# Altium schematic sheet 04_CONNECTOR_IN.SchDoc
size 420 x 297 mm; SheetNumber: 4; SheetTotal: 29
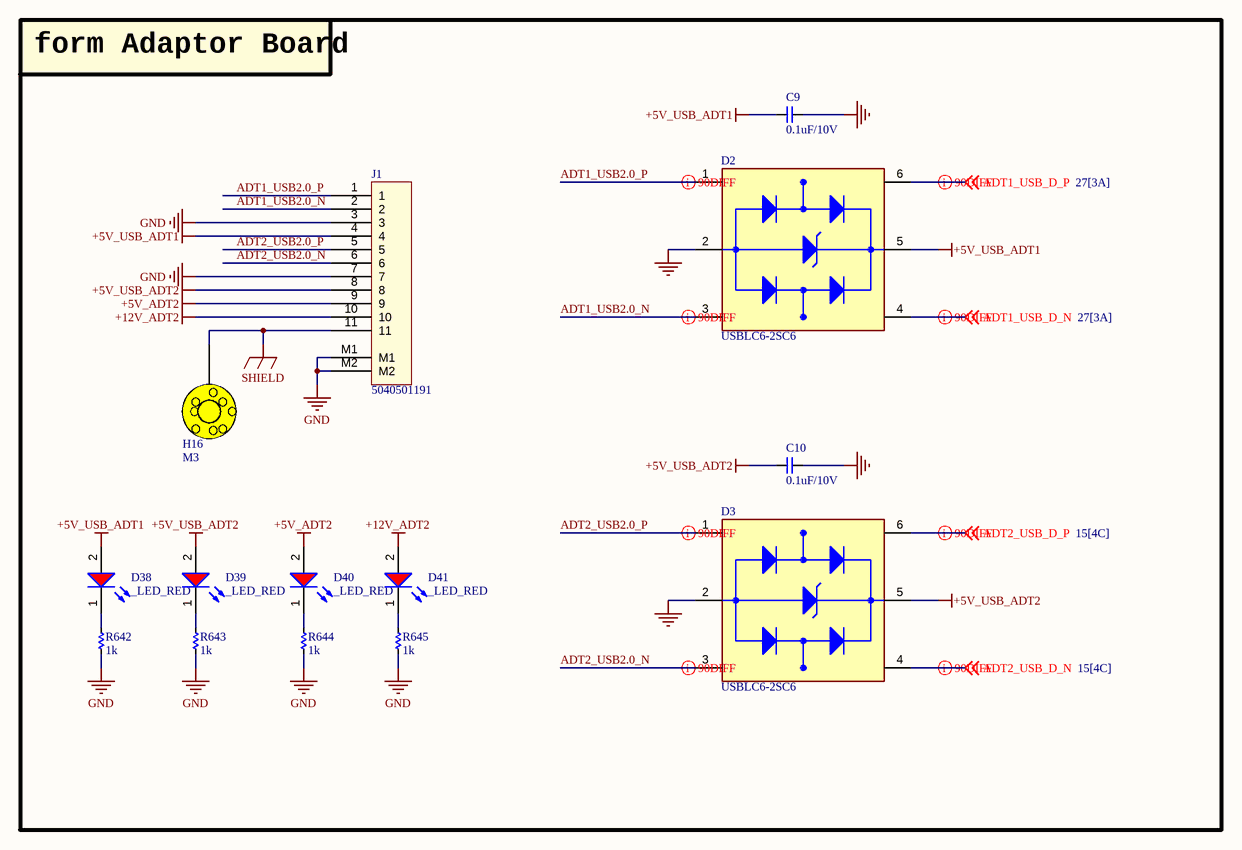
[diagram p0: 04_CONNECTOR_IN.SchDoc]

## Parts
C9  0.1uF/10V  [CAP_C_1005X60]
C10  0.1uF/10V  [CAP_C_1005X60]
D2  USBLC6-2SC6  [SOT95P280X145-6N]
D3  USBLC6-2SC6  [SOT95P280X145-6N]
D38  _LED_RED  [LED_0603]
D39  _LED_RED  [LED_0603]
D40  _LED_RED  [LED_0603]
D41  _LED_RED  [LED_0603]
H16  M3  [Testpoint_TH_D350H250]
J1  5040501191  [MOLEX_5040501191]
R642  1k  [RES_C_1005X40]
R643  1k  [RES_C_1005X40]
R644  1k  [RES_C_1005X40]
R645  1k  [RES_C_1005X40]

## Blocks framed on the sheet
form Adaptor Board: C9 C10 D2 D3 D38-D41 H16 J1 R642-R645

## Nets
+5V_ADT2: D40.2(A) J1.9
+5V_USB_ADT1: C9.2 D2.5(VBUS) D38.2(A) J1.4
+5V_USB_ADT2: C10.2 D3.5(VBUS) D39.2(A) J1.8
+12V_ADT2: D41.2(A) J1.10
GND: C9.1 C10.1 D2.2(GND) D3.2(GND) J1.3 J1.7 J1.M1 J1.M2 R642.1 R643.1 R644.1 R645.1
SHIELD: H16.1 J1.11
ADT1_USB2.0_N: D2.3(I/O2_IN) J1.2
ADT1_USB2.0_P: D2.1(I/O1_IN) J1.1
ADT1_USB_D_N: D2.4(I/O2_OUT) ; off-sheet ADT1_USB_D_N
ADT1_USB_D_P: D2.6(I/O1_OUT) ; off-sheet ADT1_USB_D_P
ADT2_USB2.0_N: D3.3(I/O2_IN) J1.6
ADT2_USB2.0_P: D3.1(I/O1_IN) J1.5
ADT2_USB_D_N: D3.4(I/O2_OUT) ; off-sheet ADT2_USB_D_N
ADT2_USB_D_P: D3.6(I/O1_OUT) ; off-sheet ADT2_USB_D_P
NetD38_1: D38.1(K) R642.2
NetD39_1: D39.1(K) R643.2
NetD40_1: D40.1(K) R644.2
NetD41_1: D41.1(K) R645.2

## Layout directives
differential pair; differential pair class DIFF90: ADT1_USB2.0_N, ADT1_USB2.0_P, ADT1_USB_D_N, ADT1_USB_D_P, ADT2_USB2.0_N, ADT2_USB2.0_P, ADT2_USB_D_N, ADT2_USB_D_P

## Notes on the sheet
- Project:
- Sub-system:
- Design by:
- Sheet title:
- Sheet
- of
- Checked by:
- Approved by:
- Revision:
- Document No:
- Size:
- Date:
- A3

## Library data of the parts
C9 C10 = _CAP_C_2: CAP CHIP
D2 D3 = USBLC6-2SC6: 17V Clamp 5A (8/20Âµs) Ipp Tvs Diode Surface Mount SOT-23-6; MF: STMicroelectronics; Value: *; SnapEDA_Link: https://www.snapeda.com/parts/USBLC6-2SC6/STMicroelectronics/view-part/?ref=snap; Check_prices: https://www.snapeda.com/parts/USBLC6-2SC6/STMicroelectronics/view-part/?ref=eda; Purchase-URL: https://pricing.snapeda.com/search/part/USBLC6-2SC6/?ref=eda; Price: None; Availability: In Stock; Package: SOT-23-6 STMicroelectronics; MP: USBLC6-2SC6
H16 = HEX-M3
J1 = Header 11x1_2M
R642-R645 = _RES_B_2: RES